# EAGLE schematic EVGP_Estop_Daugherboard (EAGLE 9.5.1)
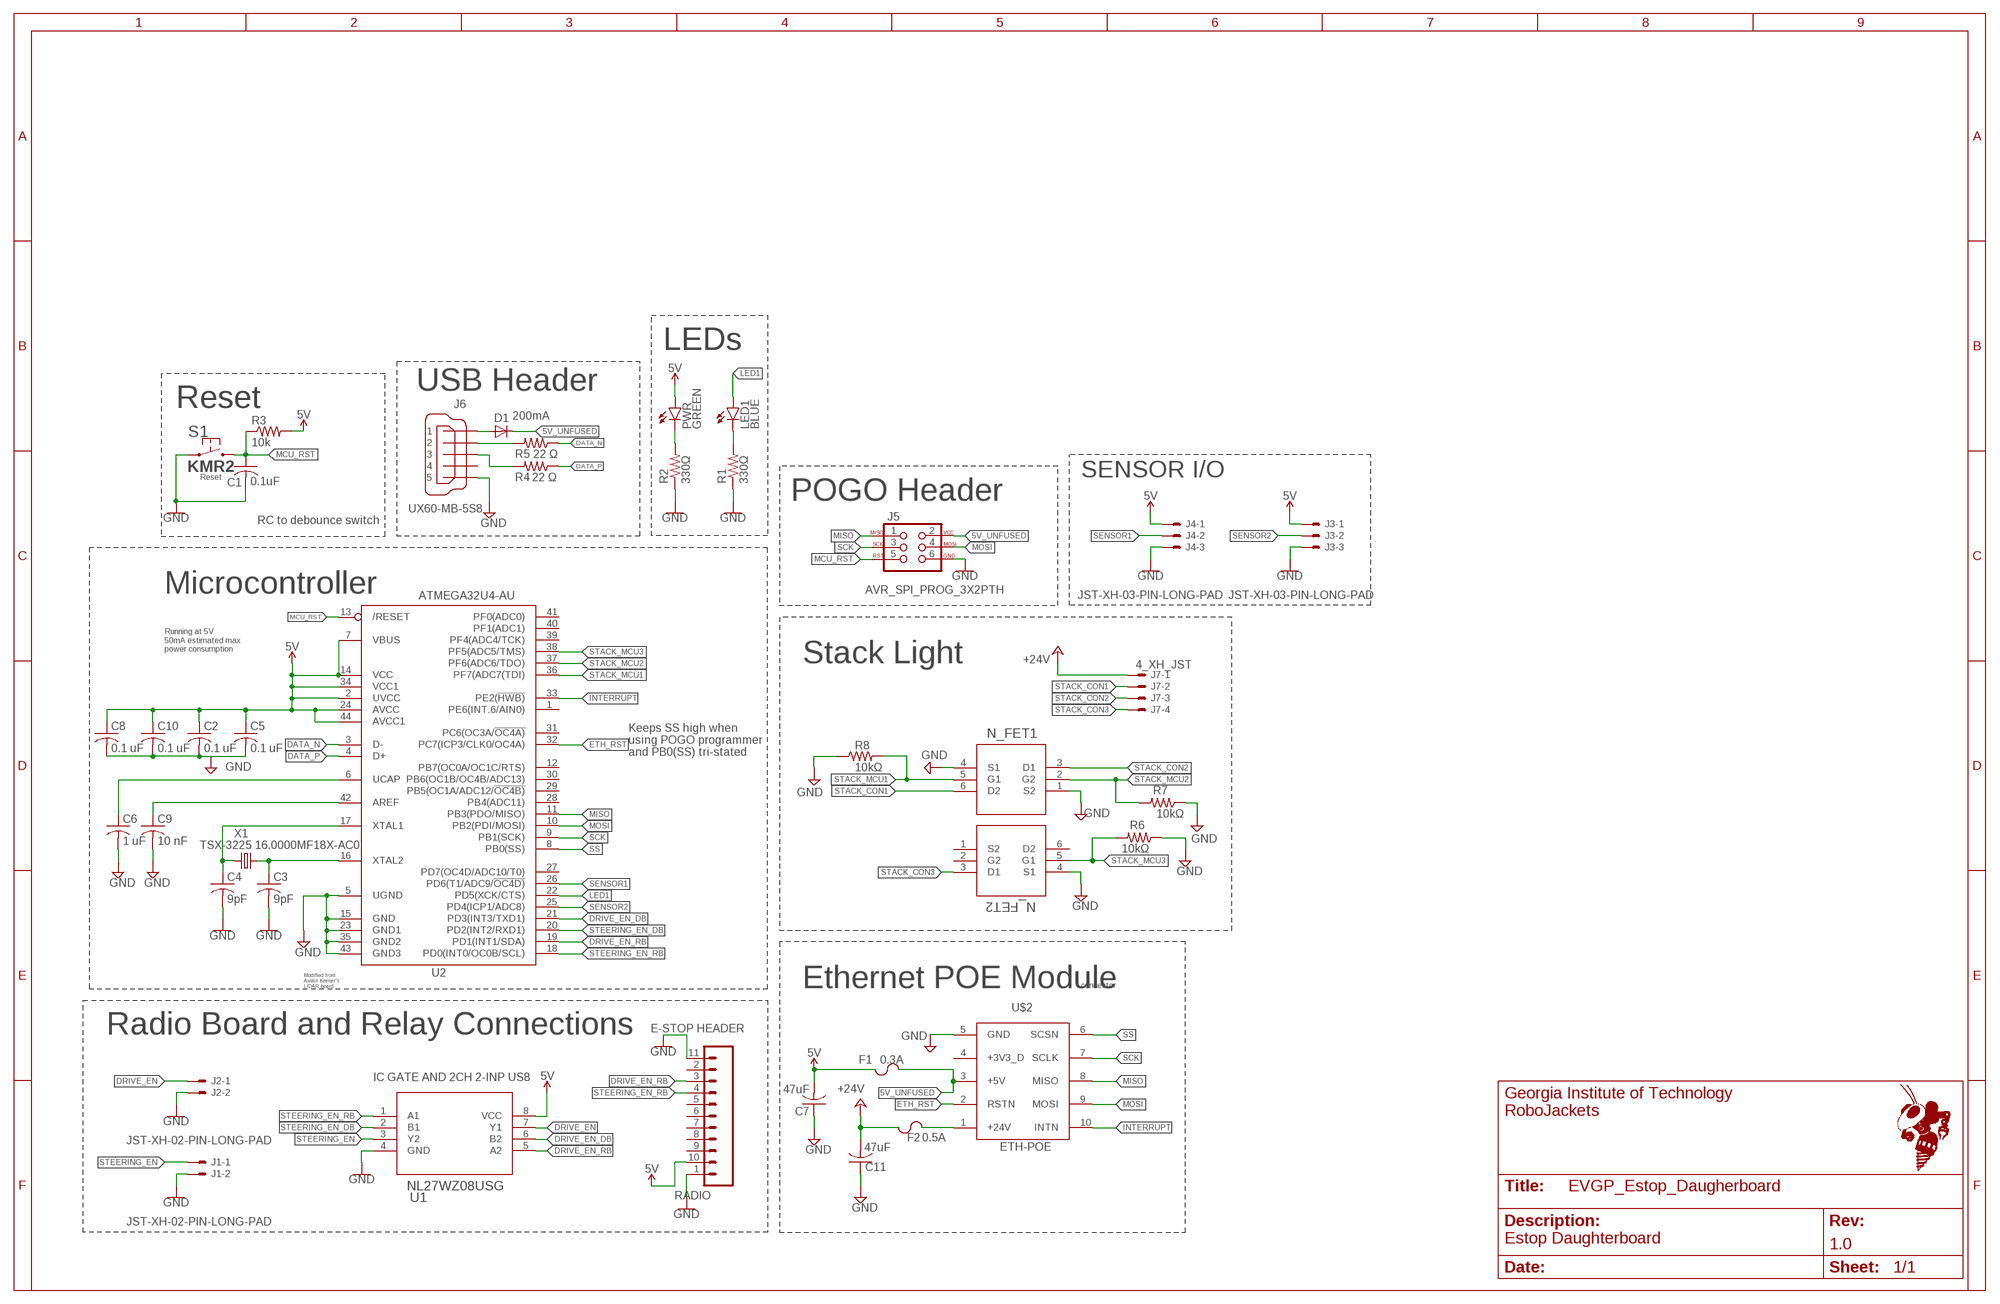
[diagram p0: schematic, sheet 1]
FRAME1 (FRAME_B_L): REVISION: 1.0; SCH_DESC: EVGP Steering Control Board
FRAME2 (FRAME_B_L): REVISION: 1.0; SCH_DESC: EVGP Steering Control Board

## Parts
C1  0.1uF  C-USC0603  [C0603]
C2  0.1 uF  C-USC0603  [C0603]
C3  9pF  C-USC0603  [C0603]
C4  9pF  C-USC0603  [C0603]
C5  0.1 uF  C-USC0603  [C0603]
C6  1 uF  C-USC0603  [C0603]
C7  47uF  C-USC1206  [C1206]
C8  0.1 uF  C-USC0603  [C0603]
C9  10 nF  C-USC0603  [C0603]
C10  0.1 uF  C-USC0603  [C0603]
C11  47uF  C-USC1206  [C1206]
D1  200mA  DIODE-SOD323-R  [SOD323-R]
F1  0.3A  CHIP_FUSE1206  [F1206]
F2  0.5A  CHIP_FUSE1206  [F1206]
J1  JST-XH-02-PIN-LONG-PAD  [JST-XH-02-PACKAGE-LONG-PAD]
J2  JST-XH-02-PIN-LONG-PAD  [JST-XH-02-PACKAGE-LONG-PAD]
J3  JST-XH-03-PIN-LONG-PAD  [JST-XH-03-PACKAGE-LONG-PAD]
J4  JST-XH-03-PIN-LONG-PAD  [JST-XH-03-PACKAGE-LONG-PAD]
J5  AVR_SPI_PROG_3X2PTH  [2X3]
J6  UX60-MB-5S8  [UX60-MB-5S8]
J7  4_XH_JST  JST-XH-04-PIN-LONG-PAD  [JST-XH-04-PACKAGE-LONG-PAD]
LED1  BLUE  LEDCHIP-LED0603  [CHIP-LED0603]
PWR  GREEN  LEDCHIP-LED0603  [CHIP-LED0603]
Q1  N_FET2  BSS84DW-7-F  [SOT-363]
Q2  N_FET1  BSS84DW-7-F  [SOT-363]
R1  330Ω  R-US_R0603  [R0603]
R2  330Ω  R-US_R0603  [R0603]
R3  10k  R-US_R0603  [R0603]
R4  22 Ω  R-US_R0603  [R0603]
R5  22 Ω  R-US_R0603  [R0603]
R6  10kΩ  R-US_R0603  [R0603]
R7  10kΩ  R-US_R0603  [R0603]
R8  10kΩ  R-US_R0603  [R0603]
RADIO  E-STOP HEADER  ESTOP_RADIO  [RADIO_V1.3]
S1  KMR2  [KMR2]
U1  NL27WZ08USG  [US8_2P40X2P10]
U2  ATMEGA32U4-AU  [TQFP44]
U$2  ETH-POE  [HDRVR10W64P4000X254_2X5_1016X508X254B]
X1  TSX-3225 16.0000MF18X-AC0  XTAL-3.2X2.5  [XTAL-3.2X2.5]

## Nets
5V [power]: C2.1 C5.1 C7.2 C8.1 C10.1 F1.1 J3.1 J4.1 PWR.A R3.2 RADIO.10(5V) U1.8(VCC) U2.2(UVCC) U2.7(VBUS) U2.14(VCC) U2.24(AVCC) U2.34(VCC1) U2.44(AVCC1)
5V_UNFUSED [power]: D1.C F1.2 J5.2 U$2.3(+5V)
24V_UNFUSED: F2.2 U$2.1(+24V)
+24V: C11.2 F2.1 J7.1
AREF: C9.1 U2.42(AREF)
DATA_N [RF]: R5.1 U2.3(D-)
DATA_P [RF]: R4.1 U2.4(D+)
DRIVE_EN: J2.1 U1.7(Y1)
DRIVE_EN_DB: U1.6(B2) U2.21(PD3(INT3/TXD1))
DRIVE_EN_RB: RADIO.3(D1) U1.5(A2) U2.19(PD1(INT1/SDA))
ETH_RST: U2.32(PC7(ICP3/CLK0/OC4A)) U$2.2(RSTN)
GND [power]: C1.2 C2.2 C3.2 C4.2 C5.2 C6.2 C7.1 C8.2 C9.2 C10.2 C11.1 J1.2 J2.2 J3.3 J4.3 J5.6 J6.5 Q1.4(S1) Q2.1(S2) Q2.4(S1) R1.1 R2.1 R6.1 R7.1 R8.1 RADIO.1(GND) RADIO.11(GND) S1.1.1 S1.1.2 U1.4(GND) U2.5(UGND) U2.15(GND) U2.23(GND1) U2.35(GND2) U2.43(GND3) U$2.5(GND)
INTERRUPT: U2.33(PE2(!HWB)) U$2.10(INTN)
LED1: LED1.A U2.22(PD5(XCK/CTS))
MCU_RST: C1.1 J5.5 R3.1 S1.2.1 S1.2.2 U2.13(/RESET)
MISO: J5.1 U2.11(PB3(PDO/MISO)) U$2.8(MISO)
MOSI: J5.4 U2.10(PB2(PDI/MOSI)) U$2.9(MOSI)
N$3: PWR.C R2.2
N$5: J6.2 R5.2
N$6: LED1.C R1.2
N$7: D1.A J6.1
N$11: J6.3 R4.2
SCK: J5.3 U2.9(PB1(SCK)) U$2.7(SCLK)
SENSOR1: J4.2 U2.26(PD6(T1/ADC9/!OC4D))
SENSOR2: J3.2 U2.25(PD4(ICP1/ADC8))
SS: U2.8(PB0(SS)) U$2.6(SCSN)
STACK_CON1: J7.2 Q2.6(D2)
STACK_CON2: J7.3 Q2.3(D1)
STACK_CON3: J7.4 Q1.3(D1)
STACK_MCU1: Q2.5(G1) R8.2 U2.36(PF7(ADC7(TDI))
STACK_MCU2: Q2.2(G2) R7.2 U2.37(PF6(ADC6/TDO))
STACK_MCU3: Q1.5(G1) R6.2 U2.38(PF5(ADC5/TMS))
STEERING_EN: J1.1 U1.3(Y2)
STEERING_EN_DB: U1.2(B1) U2.20(PD2(INT2/RXD1))
STEERING_EN_RB: RADIO.4(D2) U1.1(A1) U2.18(PD0(INT0/OC0B/SCL))
UCAP: C6.1 U2.6(UCAP)
XTAL1: C4.1 U2.17(XTAL1) X1.1
XTAL2: C3.1 U2.16(XTAL2) X1.3
Unconnected: J6.4 Q1.1(S2) Q1.2(G2) Q1.6(D2) RADIO.2(RST) RADIO.5(D3) RADIO.6(D4) RADIO.7(D5) RADIO.8(D6) RADIO.9(D7) U2.1(PE6(INT.6/AIN0)) U2.12(PB7(OC0A/OC1C/RTS)) U2.27(PD7(OC4D/ADC10/T0)) U2.28(PB4(ADC11)) U2.29(PB5(OC1A/ADC12/!OC4B)) U2.30(PB6(OC1B/OC4B/ADC13)) U2.31(PC6(OC3A/!OC4A)) U2.39(PF4(ADC4/TCK)) U2.40(PF1(ADC1)) U2.41(PF0(ADC0)) U$2.4(+3V3_D)

## Notes on the sheet
- LEDs
- USB Header
- Reset
- SENSOR I/O
- POGO Header
- RC to debounce switch
- Microcontroller
- Running at 5V
  50mA estimated max
  power consumption
- Stack Light
- Keeps SS high when
  using POGO programmer
  and PB0(SS) tri-stated
- Modified from 
  Austin Keener's 
  LIDAR board
- Ethernet POE Module | connector
- Radio Board and Relay Connections
- IC GATE AND 2CH 2-INP US8
- Estop Daughterboard

## Library data of the parts
C1 C7 C11 = rcl:C-US: CAPACITOR, American symbol; SPICEPREFIX: C
C2-C6 C8-C10 = resistor:C-US: CAPACITOR, American symbol
D1 = RoboJackets-Diodes:DIODE-: DIODE
F1 F2 = RoboJackets-Fuses:CHIP_FUSE
J1 J2 = Rembrandt Electronics - JST XH Connectors v1-0:JST-XH-02-PIN: JST XH Connector 2 Pin Wire to board connector. Pitch: 2,54 mm, (0.100") Number of pins: 2 Created by Rembrandt Electronics www.rembrandtelectronics.com
J3 J4 = Rembrandt Electronics - JST XH Connectors v1-0:JST-XH-03-PIN: JST XH Connector 2 Pin Wire to board connector. Pitch: 2,54 mm, (0.100") Number of pins: 3 Created by Rembrandt Electronics www.rembrandtelectronics.com
J5 = SparkFun-Connectors:AVR_SPI_PROG_3X2: AVR ISP 6 Pin This is the reduced ISP connector for AVR programming. Common on Arduino. This footprint will take up less PCB space and can be used with a 10-pin to 6-pin adapter such as SKU: BOB-08508 **Special note about "TEST_POINT" package. The stop mask is on the top side, so if you want your programming test points to be on the bottom of your board, make sure to place this package on the bottom side of the board. This also ensure that the orientation to program from the bottom side will be correct. SparkFun Products: SparkFun ISP Pogo Adapter <https://www.sparkfun.com/products/11591> - NS Tiny AVR Programmer <https://www.sparkfun.com/products/11801> -PTH
J6 = RoboJackets-Connectors:UX60*-MB-5S?: Mini USB Connector Brand: Hirose Electric Co Ltd <http://www.hirose.com/us/> Series: UX <http://www.digikey.com/product-search/en?FV=fff40016,fff802e4,ffec3225> Distributor: Digi-Key <http://www.digikey.com/product-detail/en/UX60A-MB-5ST/H2961CT-ND/597540>; PINS: 5
J7 = Rembrandt Electronics - JST XH Connectors v1-0:JST-XH-04-PIN: JST XH Connector 2 Pin Wire to board connector. Pitch: 2,54 mm, (0.100") Number of pins: 4 Created by Rembrandt Electronics www.rembrandtelectronics.com
LED1 PWR = led:LED: LED OSRAM: - CHIPLED LG R971, LG N971, LY N971, LG Q971, LY Q971, LO R971, LY R971 LH N974, LH R974 LS Q976, LO Q976, LY Q976 LO Q996 - Hyper CHIPLED LW Q18S LB Q993, LB Q99A, LB R99A - SideLED LS A670, LO A670, LY A670, LG A670, LP A670 LB A673, LV A673, LT A673, LW A673 LH A674 LY A675 LS A676, LA A676, LO A676, LY A676, LW A676 LS A679, LY A679, LG A679 - Hyper Micro SIDELED® LS Y876, LA Y876, LO Y876, LY Y876 LT Y87S - SmartLED LW L88C, LW L88S LB L89C, LB L89S, LG L890 LS L89K, LO L89K, LY L89K LS L896, LA L896, LO L896, LY L896 - TOPLED LS T670, LO T670, LY T670, LG T670, LP T670 LSG T670, LSP T670, LSY T670, LOP T670, LYG T670 LG T671, LOG T671, LSG T671 LB T673, LV T673, LT T673, LW T673 LH T674 LS T676, LA T676, LO T676, LY T676, LB T676, LH T676, LSB T676, LW T676 LB T67C, LV T67C, LT T67C, LS T67K, LO T67K, LY T67K, LW E67C LS E67B, LA E67B, LO E67B, LY E67B, LB E67C, LV E67C, LT E67C LW T67C LS T679, LY T679, LG T679 LS T770, LO T770, LY T770, LG T770, LP T770 LB T773, LV T773, LT T773, LW T773 LH T774 LS E675, LA E675, LY E675, LS T675 LS T776, LA T776, LO T776, LY T776, LB T776 LHGB T686 LT T68C, LB T68C - Hyper Mini TOPLED® LB M676 - Mini TOPLED Santana® LG M470 LS M47K, LO M47K, LY M47K Source: http://www.osram.convergy.de LUXEON: - LUMILED® LXK2-PW12-R00, LXK2-PW12-S00, LXK2-PW14-U00, LXK2-PW14-V00 LXK2-PM12-R00, LXK2-PM12-S00, LXK2-PM14-U00 LXK2-PE12-Q00, LXK2-PE12-R00, LXK2-PE12-S00, LXK2-PE14-T00, LXK2-PE14-U00 LXK2-PB12-K00, LXK2-PB12-L00, LXK2-PB12-M00, LXK2-PB14-N00, LXK2-PB14-P00, LXK2-PB14-Q00 LXK2-PR12-L00, LXK2-PR12-M00, LXK2-PR14-Q00, LXK2-PR14-R00 LXK2-PD12-Q00, LXK2-PD12-R00, LXK2-PD12-S00 LXK2-PH12-R00, LXK2-PH12-S00 LXK2-PL12-P00, LXK2-PL12-Q00, LXK2-PL12-R00 Source: www.luxeon.com KINGBRIGHT: KA-3528ASYC Source: www.kingbright.com
Q1 Q2 = Daughterboard-Stuff:BSS84DW-7-F: dual mosfet; MANUFACTURER_PART_NUMBER: BSS84DW7F; VENDOR: Diodes Inc
R1-R8 = rcl:R-US_: RESISTOR, American symbol; SPICEPREFIX: R
RADIO = board_outline:ESTOP_RADIO
S1 = RoboJackets-Switches:KMR2; FUNCTION: Reset
U1 = Daughterboard-Stuff:NL27WZ08USG; MANUFACTURER_PART_NUMBER: NL27WZ08USG; VENDOR: ON Semiconductor
U2 = estop-v1.0:ATMEGA32U4: http://www.ladyada.net/library/eagle
U$2 = ethernet_poe:ETH-POE: POE
X1 = RoboJackets-FreqGen:XTAL

## Net classes
0 default: width 0.203 mm, drill 0.508 mm, clearance 0.178 mm
1 power: width 0.305 mm, drill 0.508 mm, clearance 0.178 mm
2 RF: width 0.203 mm, clearance 0.178 mm